# Altium schematic sheet Voltage_measure.SchDoc: Buck Sinc Converter
size A4; Organization: UDESC; Revision: R0; SheetNumber: 6; SheetTotal: 10
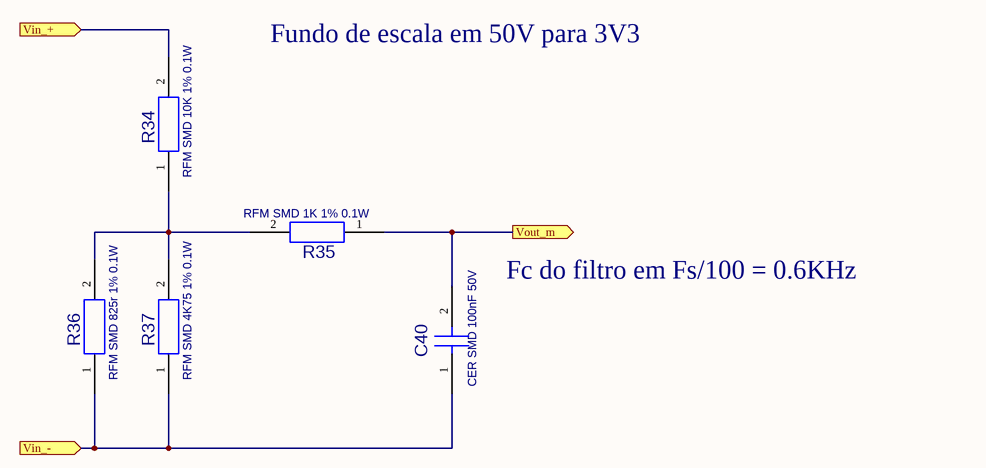
[diagram p0: Voltage_measure.SchDoc]

## Parts
C40  value CER SMD 100nF 50V  [C0805_R_V0]  (hidden comment: 10192075)
R34  value RFM SMD 10K 1% 0.1W  [R0805_R_V0]  (hidden comment: 10118076)
R35  value RFM SMD 1K 1% 0.1W  [R0805_R_V0]  (hidden comment: 10118077)
R36  value RFM SMD 825r 1% 0.1W  [R0805_R_V0]  (hidden comment: 10191983)
R37  value RFM SMD 4K75 1% 0.1W  [R0805_R_V0]  (hidden comment: 10191972)

## Ports
Vin_+ (in), Vin_- (in), Vout_m (out)

## Nets
Vin_+: R34.2 ; port Vin_+
Vin_-: C40.1 R36.1 R37.1 ; port Vin_-
Vout_m: C40.2 R35.1 ; port Vout_m
NetR34_1: R34.1 R35.2 R36.2 R37.2

## Notes on the sheet
- Fundo de escala em 50V para 3V3
- Fc do filtro em Fs/100 = 0.6KHz
- Title
- Size:
- Date:
- A4
- Number:
- Time:
- Revision:
- Sheet
- of
- File:

## Library data of the parts
C40 = 10192075: CER SMD 100nF 50V; HISsym: Atualizado em 12/07/05; TOL: 10%; ITEM BAAN: 0333.0044; PN: 10192075; PMT: SMD
R34 = 10118077: RFM SMD 10K 1% 0.1W; HISsym: Atualizado em 20/07/05; PN: 10118076; PMT: SMD
R35 = 10118077: RFM SMD 1K 1% 0.1W; HISsym: Atualizado em 20/07/05; PN: 10118077; PMT: SMD
R36 = 10118077: RFM SMD 825r 1% 0.1W; HISsym: Atualizado em 20/07/05; PN: 10191983; PMT: SMD
R37 = 10118077: RFM SMD 4K75 1% 0.1W; HISsym: Atualizado em 20/07/05; PN: 10191972; PMT: SMD